# EAGLE schematic CANBUS_USB (EAGLE 9.6.2)
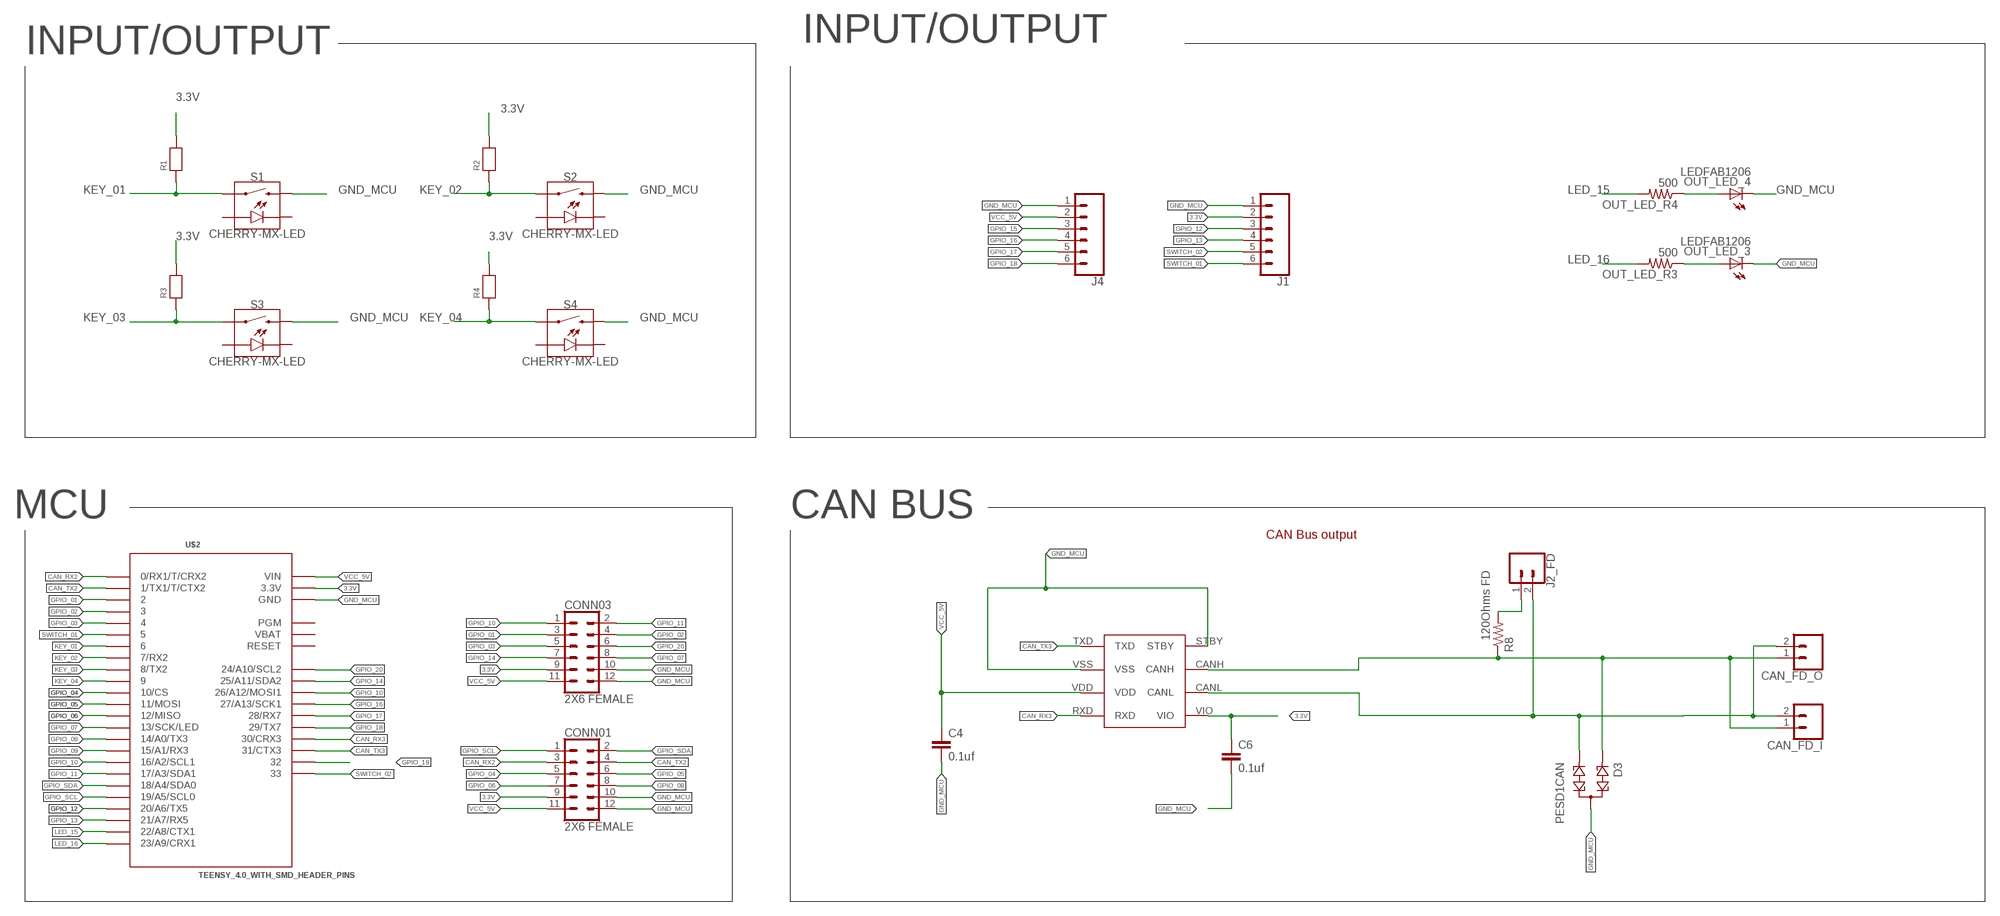
[diagram p0: schematic, sheet 1, part 1 of 2]
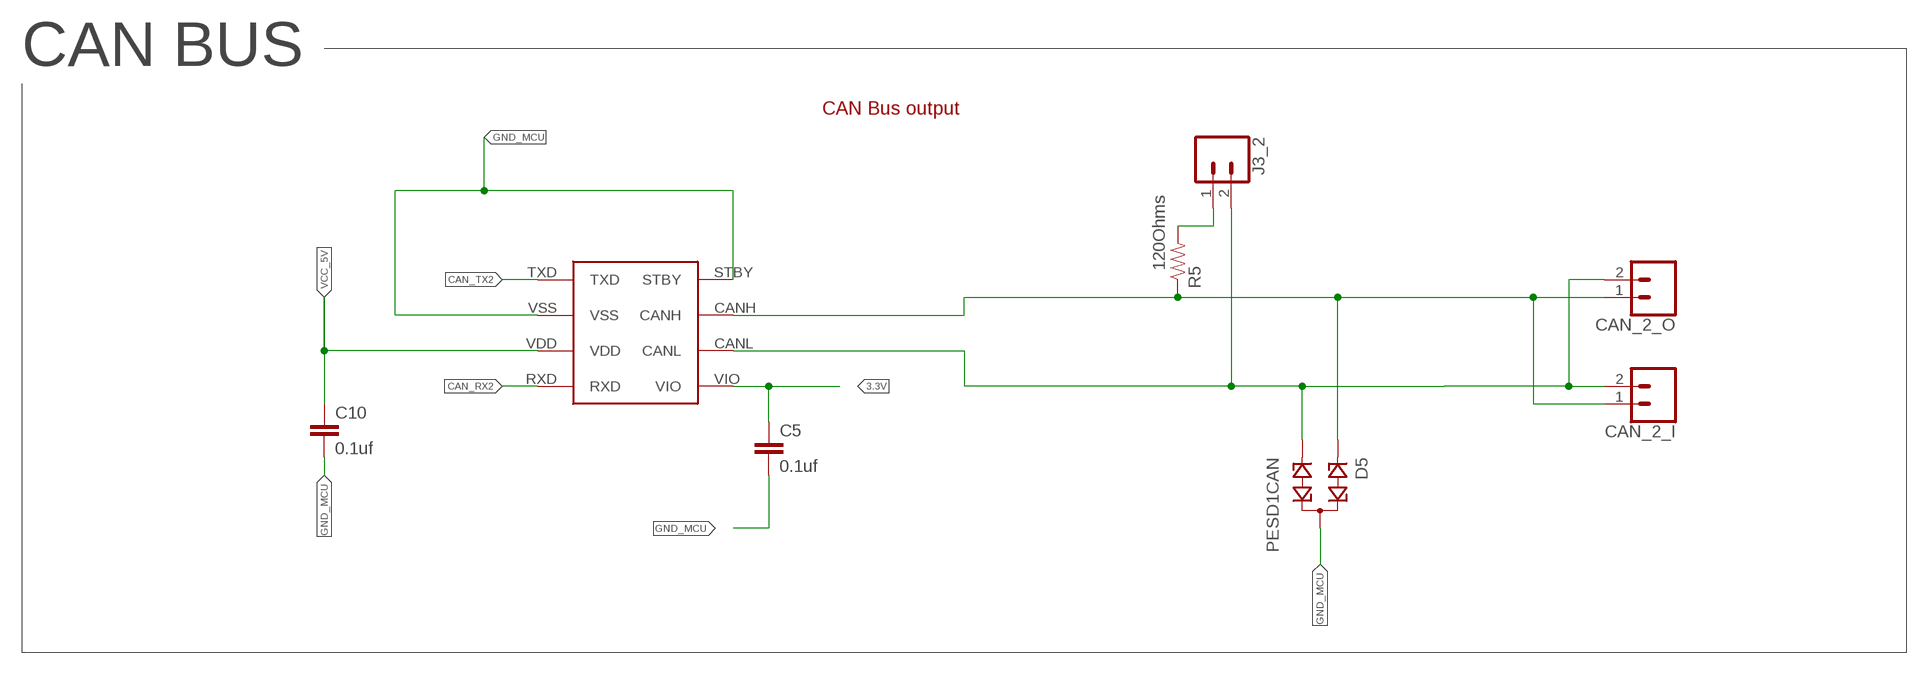
[diagram p1: schematic, sheet 1, part 2 of 2]

## Parts
C4  0.1uf  0.1UF-25V(+80/-20%)(0603)  [0603-CAP]
C5  0.1uf  0.1UF-25V(+80/-20%)(0603)  [0603-CAP]
C6  0.1uf  0.1UF-25V(+80/-20%)(0603)  [0603-CAP]
C10  0.1uf  0.1UF-25V(+80/-20%)(0603)  [0603-CAP]
CAN_2_I  CONN_02-JST-2MM-SMT  [JST-2-SMD]
CAN_2_O  CONN_02-JST-2MM-SMT  [JST-2-SMD]
CAN_FD_I  CONN_02-JST-2MM-SMT  [JST-2-SMD]
CAN_FD_O  CONN_02-JST-2MM-SMT  [JST-2-SMD]
CONN01  2X6 FEMALE  CONN_06X2PTH_FEMALE  [2X6]
CONN03  2X6 FEMALE  CONN_06X2PTH_FEMALE  [2X6]
D3  PESD1CAN  [SOT23]
D5  PESD1CAN  [SOT23]
J1  CONN_06SMD-1MM  [1X06-1MM]
J2_FD  CONN_02  [1X02]
J3_2  CONN_02  [1X02]
J4  CONN_06SMD-1MM  [1X06-1MM]
MCP2562  MCP2562  [MCP2562]
MCP2562FD  MCP2562  [MCP2562]
OUT_LED_3  LEDFAB1206  [LED1206FAB]
OUT_LED_4  LEDFAB1206  [LED1206FAB]
OUT_LED_R3  500  RES-US1206FAB  [R1206FAB]
OUT_LED_R4  500  RES-US1206FAB  [R1206FAB]
R1  RESISTOR1206  [1206]
R2  RESISTOR1206  [1206]
R3  RESISTOR1206  [1206]
R4  RESISTOR1206  [1206]
R5  120Ohms  10KOHM-1/10W-1%(0603)0603  [0603-RES]
R8  120Ohms FD  10KOHM-1/10W-1%(0603)0603  [0603-RES]
S1  CHERRY-MX-LED  [CHERRY-MX-LED]
S2  CHERRY-MX-LED  [CHERRY-MX-LED]
S3  CHERRY-MX-LED  [CHERRY-MX-LED]
S4  CHERRY-MX-LED  [CHERRY-MX-LED]
U$2  TEENSY_4.0_WITH_SMD_HEADER_PINS  [TEENSY_4.0_WITH_SMD_HEADER_PINS]

## Nets
3.3V: C5.1 C6.1 CONN01.9 CONN03.9 J1.2 MCP2562.VIO MCP2562FD.VIO R1.2 R2.2 R3.2 R4.2 U$2.3.3V U$2.3.3V1(3.3V)
CAN_H: CAN_FD_I.1 CAN_FD_O.1 D3.1 MCP2562FD.CANH R8.1
CAN_H1: CAN_2_I.1 CAN_2_O.1 D5.1 MCP2562.CANH R5.1
CAN_L: CAN_FD_I.2 CAN_FD_O.2 D3.2 J2_FD.2 MCP2562FD.CANL
CAN_L1: CAN_2_I.2 CAN_2_O.2 D5.2 J3_2.2 MCP2562.CANL
CAN_RX2: CONN01.3 MCP2562.RXD U$2.0(0/RX1/T/CRX2)
CAN_RX3: MCP2562FD.RXD U$2.30(30/CRX3)
CAN_TX2: CONN01.4 MCP2562.TXD U$2.1(1/TX1/T/CTX2)
CAN_TX3: MCP2562FD.TXD U$2.31(31/CTX3)
GND_MCU: C4.2 C5.2 C6.2 C10.2 CONN01.10 CONN01.12 CONN03.10 CONN03.12 D3.3 D5.3 J1.1 J4.1 MCP2562.STBY MCP2562.VSS MCP2562FD.STBY MCP2562FD.VSS OUT_LED_3.2(C) OUT_LED_4.2(C) S1.S2 S2.S2 S3.S2 S4.S2 U$2.GND U$2.GND1(GND) U$2.GND2(GND)
GPIO_01: CONN03.3 U$2.2
GPIO_02: CONN03.4 U$2.3
GPIO_03: CONN03.5 U$2.4
GPIO_04: CONN01.5 U$2.10(10/CS)
GPIO_05: CONN01.6 U$2.11(11/MOSI)
GPIO_06: CONN01.7 U$2.12(12/MISO)
GPIO_07: CONN03.8 U$2.13(13/SCK/LED) U$2.14/A0(14/A0/TX3)
GPIO_08: CONN01.8 U$2.14/A0(14/A0/TX3)
GPIO_09: U$2.15/A1(15/A1/RX3) U$2.17/A3(17/A3/SDA1)
GPIO_10: CONN03.1 U$2.16/A2(16/A2/SCL1) U$2.26(26/A12/MOSI1)
GPIO_11: CONN03.2 U$2.17/A3(17/A3/SDA1)
GPIO_12: J1.3 U$2.20/A6(20/A6/TX5)
GPIO_13: J1.4 U$2.21/A7(21/A7/RX5)
GPIO_14: CONN03.7 U$2.25(25/A11/SDA2) U$2.32
GPIO_15: J4.3 U$2.26(26/A12/MOSI1)
GPIO_16: J4.4 U$2.27(27/A13/SCK1)
GPIO_17: J4.5 U$2.28(28/RX7)
GPIO_18: J4.6 U$2.29(29/TX7)
GPIO_19: U$2.32
GPIO_20: CONN03.6 U$2.24(24/A10/SCL2)
GPIO_SCL: CONN01.1 U$2.19/A5(19/A5/SCL0)
GPIO_SDA: CONN01.2 U$2.18/A4(18/A4/SDA0)
KEY_01: R1.1 S1.S1 U$2.6
KEY_02: R2.1 S2.S1 U$2.7(7/RX2)
KEY_03: R3.1 S3.S1 U$2.8(8/TX2)
KEY_04: R4.1 S4.S1 U$2.9
LED_15: OUT_LED_R4.2 U$2.22/A8(22/A8/CTX1)
LED_16: OUT_LED_R3.2 U$2.23/A9(23/A9/CRX1)
N$2: J2_FD.1 R8.2
N$5: J3_2.1 R5.2
N$6: OUT_LED_3.1(A) OUT_LED_R3.1
N$7: OUT_LED_4.1(A) OUT_LED_R4.1
SWITCH_01: J1.6 U$2.5
SWITCH_02: J1.5 U$2.33
VCC_5V [vcc5]: C4.1 C10.1 CONN01.11 CONN03.11 J4.2 MCP2562.VDD MCP2562FD.VDD U$2.VIN
Unconnected: S1.A S1.K(C) S2.A S2.K(C) S3.A S3.K(C) S4.A S4.K(C) U$2.PGM U$2.RESET

## Notes on the sheet
- INPUT/OUTPUT | INPUT/OUTPUT
- MCU | CAN BUS | CAN BUS
- CAN Bus output
- CAN Bus output

## Power pins joined to a net without a drawn wire
VBAT: U$2.VBAT

## Library data of the parts
C4-C6 C10 = SparkFun-Capacitors:0.1UF-25V(+80/-20%)(0603): CAP-00810 Ceramic Standard decoupling cap; PROD_ID: CAP-00810; VALUE: 0.1uF
CAN_2_I CAN_2_O CAN_FD_I CAN_FD_O = SparkFun-Connectors:CONN_02: Multi connection point. Often used as Generic Header-pin footprint for 0.1 inch spaced/style header connections On any of the 0.1 inch spaced packages, you can populate with these: Break Away Headers - Straight <https://www.sparkfun.com/products/116> (PRT-00116) Break Away Male Headers - Right Angle <https://www.sparkfun.com/products/553> (PRT-00553) Female Headers <https://www.sparkfun.com/products/115> (PRT-00115) Break Away Headers - Machine Pin <https://www.sparkfun.com/products/117> (PRT-00117) Break Away Female Headers - Swiss Machine Pin <https://www.sparkfun.com/products/743> (PRT-00743) For SCREWTERMINALS and SPRING TERMINALS visit here: Screw Terimnals on SparkFun.com <https://www.sparkfun.com/search/results?term=Screw+Terminals> (5mm/3.5mm/2.54mm spacing) This device is also useful as a general connection point to wire up your design to another part of your project. Our various solder wires solder well into these plated through hole pads. Hook-Up Wire - Assortment (Stranded, 22 AWG) <https://www.sparkfun.com/products/11375> (PRT-11375) Hook-Up Wire - Assortment (Solid Core, 22 AWG) <https://www.sparkfun.com/products/11367> (PRT-11367) View the entire wire category on our website here <https://www.sparkfun.com/categories/141> Special notes: Molex polarized connector foot print use with: PRT-08233 with associated crimp pins and housings. 2.54_SCREWTERM for use with PRT-10571. 3.5mm Screw Terminal footprints for PRT-08084 5mm Screw Terminal footprints for use with PRT-08432; PROD_ID: CONN-11443
CONN01 CONN03 = SparkFun-Connectors:CONN_06X2: Multi connection point. Often used as Generic Header-pin footprint for 0.1 inch spaced/style header connections On any of the 0.1 inch spaced packages, you can populate with these: Break Away Headers - Straight <https://www.sparkfun.com/products/116> (PRT-00116) Break Away Male Headers - Right Angle <https://www.sparkfun.com/products/553> (PRT-00553) Female Headers <https://www.sparkfun.com/products/115> (PRT-00115) Break Away Headers - Machine Pin <https://www.sparkfun.com/products/117> (PRT-00117) Break Away Female Headers - Swiss Machine Pin <https://www.sparkfun.com/products/743> (PRT-00743); PROD_ID: CONN-12423
D3 D5 = diode:PESD1CAN: CAN bus ESD protection diode Source: http://www.nxp.com/documents/data_sheet/PESD1CAN.pdf
J1 J4 = SparkFun-Connectors:CONN_06: Multi connection point. Often used as Generic Header-pin footprint for 0.1 inch spaced/style header connections On any of the 0.1 inch spaced packages, you can populate with these: Break Away Headers - Straight <https://www.sparkfun.com/products/116> (PRT-00116) Break Away Male Headers - Right Angle <https://www.sparkfun.com/products/553> (PRT-00553) Female Headers <https://www.sparkfun.com/products/115> (PRT-00115) Break Away Headers - Machine Pin <https://www.sparkfun.com/products/117> (PRT-00117) Break Away Female Headers - Swiss Machine Pin <https://www.sparkfun.com/products/743> (PRT-00743) Arduino Stackable Header - 6 Pin <https://www.sparkfun.com/products/9280> (PRT-09280) For SCREWTERMINALS and SPRING TERMINALS visit here: Screw Terimnals on SparkFun.com <https://www.sparkfun.com/search/results?term=Screw+Terminals> (5mm/3.5mm/2.54mm spacing) This device is also useful as a general connection point to wire up your design to another part of your project. Our various solder wires solder well into these plated through hole pads. Hook-Up Wire - Assortment (Stranded, 22 AWG) <https://www.sparkfun.com/products/11375> (PRT-11375) Hook-Up Wire - Assortment (Solid Core, 22 AWG) <https://www.sparkfun.com/products/11367> (PRT-11367) View the entire wire category on our website here <https://www.sparkfun.com/categories/141>; PROD_ID: CONN-08249; SF_ID: GPS-00579
J2_FD J3_2 = SparkFun-Connectors:CONN_02: Multi connection point. Often used as Generic Header-pin footprint for 0.1 inch spaced/style header connections On any of the 0.1 inch spaced packages, you can populate with these: Break Away Headers - Straight <https://www.sparkfun.com/products/116> (PRT-00116) Break Away Male Headers - Right Angle <https://www.sparkfun.com/products/553> (PRT-00553) Female Headers <https://www.sparkfun.com/products/115> (PRT-00115) Break Away Headers - Machine Pin <https://www.sparkfun.com/products/117> (PRT-00117) Break Away Female Headers - Swiss Machine Pin <https://www.sparkfun.com/products/743> (PRT-00743) For SCREWTERMINALS and SPRING TERMINALS visit here: Screw Terimnals on SparkFun.com <https://www.sparkfun.com/search/results?term=Screw+Terminals> (5mm/3.5mm/2.54mm spacing) This device is also useful as a general connection point to wire up your design to another part of your project. Our various solder wires solder well into these plated through hole pads. Hook-Up Wire - Assortment (Stranded, 22 AWG) <https://www.sparkfun.com/products/11375> (PRT-11375) Hook-Up Wire - Assortment (Solid Core, 22 AWG) <https://www.sparkfun.com/products/11367> (PRT-11367) View the entire wire category on our website here <https://www.sparkfun.com/categories/141> Special notes: Molex polarized connector foot print use with: PRT-08233 with associated crimp pins and housings. 2.54_SCREWTERM for use with PRT-10571. 3.5mm Screw Terminal footprints for PRT-08084 5mm Screw Terminal footprints for use with PRT-08432
MCP2562 MCP2562FD = MCP2562:MCP2562
OUT_LED_3 OUT_LED_4 = fab:LED: LED
OUT_LED_R3 OUT_LED_R4 = fab:RES-US: Resistor (US Symbol) Variants with postfix FAB are widened to allow the routing of internal traces
R1-R4 = microbuilder:RESISTOR: Resistors 0402 - 0402 Surface Mount Package 22 Ohm 1% 1/16W [Digikey: 311-22.0LRTR-ND] 33 Ohm 5% 1/16W 1.0K 5% 1/16W 1.5K 5% 1/16W 2.0K 1% 1/16W 10.0K 1% 1/16W [Digikey: 311-10.0KLRTR-ND] 10.0K 5% 1/16W [Digikey: RMCF0402JT10K0TR-ND] 12.1K 1% 1/16W [Digikey: 311-22.0LRTR-ND] 100.0K 5% 1/16W 0603 - 0603 Surface Mount Package 0 Ohm 1/10 Watt 1% Resistor 15 Ohm 1/10 Watt 1% Resistor 33 Ohm 1/10 Watt 1% Resistor 49.9 Ohm 1/10 Watt 1% Resistor 100 Ohm 1/10 Watt 1% Resistor 150 Ohm 1/10 Watt 1% Resistor 240 Ohm 1/10 Watt 1% Resistor 390 Ohm 1/10 Watt 1% Resistor 560 Ohm 1/10 Watt 1% Resistor 680 Ohm 1/10 Watt 1% Resistor 750 Ohm 1/10 Watt 1% Resistor 1.0K Ohm 1/10 Watt 1% Resistor 1.5K Ohm 1/10 Watt 1% Resistor 2.0K Ohm 1/10 Watt 1% Resistor 2.2K Ohm 1/10 Watt 1% Resistor 3.3K Ohm 1/10 Watt 1% Resistor 4.7K Ohm 1/10 Watt 1% Resistor 10.0K Ohm 1/10 Watt 1% Resistor 12.0K Ohm 1/10 Watt 1% Resistor 12.1K Ohm 1/10 Watt 1% Resistor 20.0K Ohm 1/10 Watt 1% Resistor 33.0K Ohm 1/10 Watt 1% Resistor 100.0K Ohm 1/10 Watt 1% Resistor 0805 - 0805 Surface Mount Package 0 Ohm 1/8 Watt 1% Resistor 33 Ohm 1/8 Watt 1% Resistor 100 Ohm 1/8 Watt 1% Resistor 150 Ohm 1/8 Watt 1% Resistor 200 Ohm 1/8 Watt 1% Resistor 240 Ohm 1/8 Watt 1% Resistor 330 Ohm 1/8 Watt 1% Resistor 390 Ohm 1/8 Watt 1% Resistor 470 Ohm 1/8 Watt 1% Resistor 1.0K Ohm 1/8 Watt 1% Resistor 1.5K Ohm 1/8 Watt 1% Resistor 2.0K Ohm 1/8 Watt 1% Resistor 4.7K Ohm 1/8 Watt 1% Resistor 5.1K Ohm 1/8 Watt 1% Resistor 5.6K Ohm 1/8 Watt 1% Resistor 10.0K Ohm 1/8 Watt 1% Resistor 22.0K Ohm 1/8 Watt 1% Resistor 33.0K Ohm 1/8 Watt 1% Resistor 100K Ohm 1/8 Watt 1% Resistor 1206 - 1206 Surface Mount Package 2012 - 2010 Surface Mount Package 0.11 Ohm 1/2 Watt 1% Resistor - Digikey: RHM.11UCT-ND
R5 R8 = SparkFun-Resistors:10KOHM-1/10W-1%(0603): RES-00824; PROD_ID: RES-00824; VALUE: 10K
S1-S4 = cherry-temp:CHERRY-MX-LED
U$2 = Teensy4:TEENSY_4.0_WITH_SMD_HEADER_PINS: Footprint for Teensy 3.1 or 3.2 board using all pin connections on the outer perimeter

## Net classes
0 default: width 0.2 mm, clearance 0.2 mm
1 gnd: width 0.2 mm, clearance 0.2 mm
3 vcc: width 0.35 mm, clearance 0.2 mm
4 vcc5: width 0.35 mm, clearance 0.2 mm